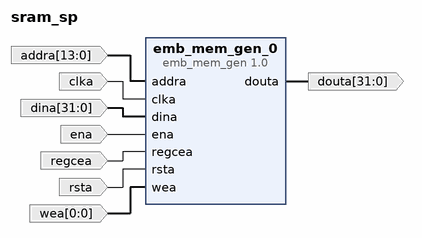
[diagram p0: block diagram of the top level]
# Vivado block design sram_sp, xcvh1582-vsva3697-2MP-e-S, Vivado 2024.2
create_bd_design sram_sp

create_bd_port -dir I -from 13 -to 0 addra
create_bd_port -dir I -from 0 -to 0 wea
create_bd_port -dir I -type rst rsta
create_bd_port -dir I ena
create_bd_port -dir O -from 31 -to 0 douta
create_bd_port -dir I -from 31 -to 0 dina
create_bd_port -dir I -type clk clka
create_bd_port -dir I regcea

create_bd_cell -type ip -vlnv xilinx.com:ip:emb_mem_gen:1.0 emb_mem_gen_0
set_property -dict [list \
  CONFIG.MEMORY_DEPTH 16384 \
  CONFIG.MEMORY_INIT_FILE ../../../../../../../../project_gemma3_pcie_integrate_sw/vhk158_llm_accelerator/vhk158_llm_accelerator.srcs/sources_1/imports/coefficient/image32.mem \
  CONFIG.READ_LATENCY_A 1 \
  CONFIG.USE_MEMORY_BLOCK Stand_Alone \
] [get_bd_cells emb_mem_gen_0]

# ---- connections ----

connect_bd_net -net addra_0_1 [get_bd_ports addra] [get_bd_pins emb_mem_gen_0/addra]
connect_bd_net -net clka_0_1 [get_bd_ports clka] [get_bd_pins emb_mem_gen_0/clka]
connect_bd_net -net dina_0_1 [get_bd_ports dina] [get_bd_pins emb_mem_gen_0/dina]
connect_bd_net [get_bd_pins emb_mem_gen_0/douta] [get_bd_ports douta]
connect_bd_net -net ena_0_1 [get_bd_ports ena] [get_bd_pins emb_mem_gen_0/ena]
connect_bd_net -net regcea_0_1 [get_bd_ports regcea] [get_bd_pins emb_mem_gen_0/regcea]
connect_bd_net -net rsta_0_1 [get_bd_ports rsta] [get_bd_pins emb_mem_gen_0/rsta]
connect_bd_net -net wea_0_1 [get_bd_ports wea] [get_bd_pins emb_mem_gen_0/wea]

validate_bd_design
save_bd_design
